# EAGLE design pnp_fuzz_face_clone (EAGLE 5.07)
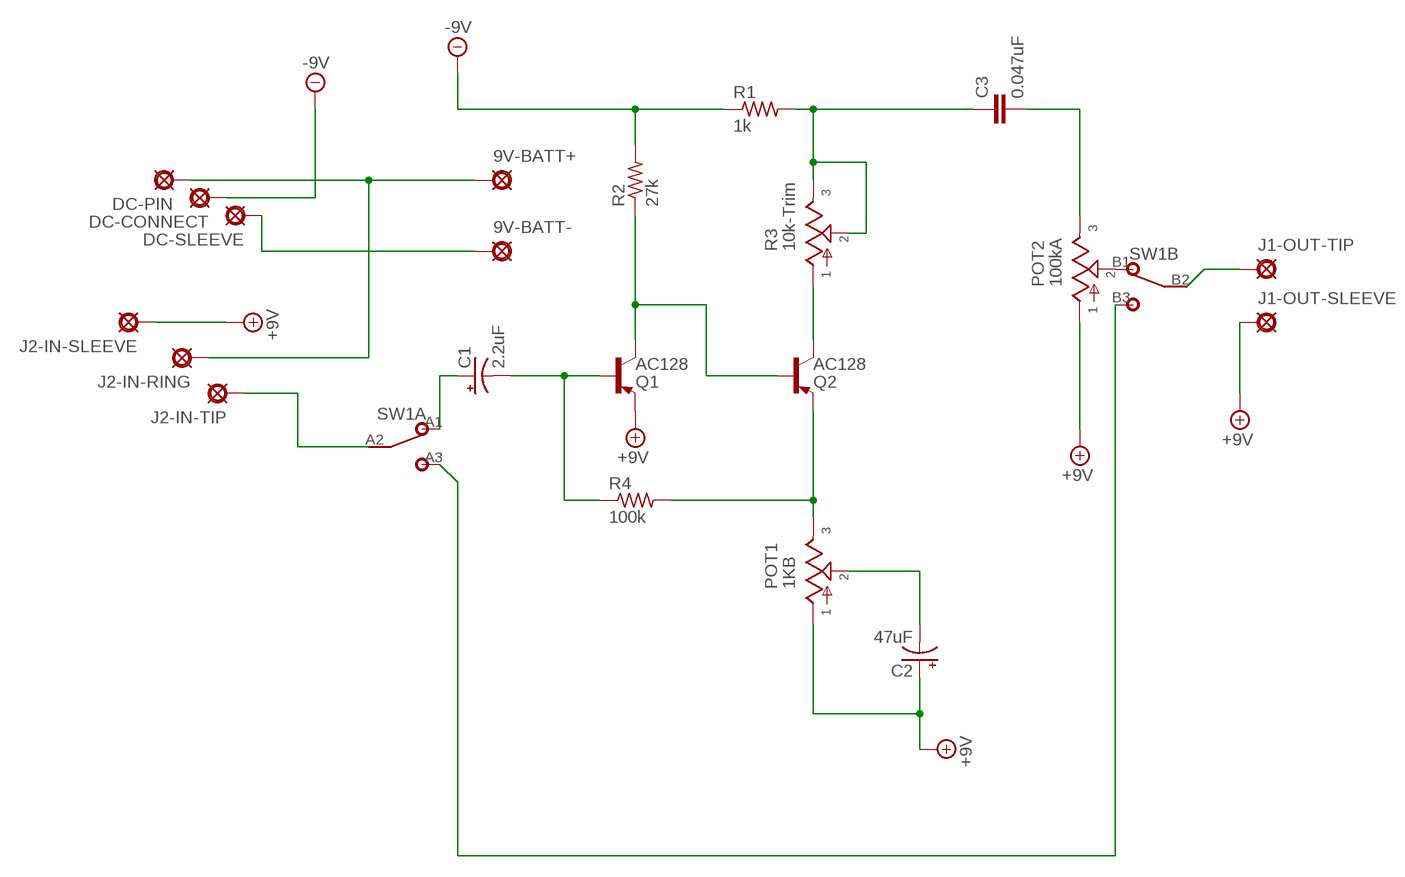
[diagram p0: schematic, sheet 1]

## Parts
9V-BATT+  PAD  [SQUARE]
9V-BATT-  PAD8  [OCTOGON]
C1  2.2uF  0502  [050_020_2]
C2  47uF  050  [050_020]
C3  0.047uF  099X056_036.3  [099X056_3]
DC-CONNECT  PAD8  [OCTOGON]
DC-PIN  PAD  [SQUARE]
DC-SLEEVE  PAD8  [OCTOGON]
J1-OUT-SLEEVE  PAD8  [OCTOGON]
J1-OUT-TIP  PAD  [SQUARE]
J2-IN-RING  PAD8  [OCTOGON]
J2-IN-SLEEVE  PAD8  [OCTOGON]
J2-IN-TIP  PAD8  [OCTOGON]
POT1  1KB  POT  [POT]
POT2  100kA  POT  [POT]
Q1  AC128  2N5087  [TO92]
Q2  AC128  2N5087  [TO92]
R1  1k  3MM.3  [R0204/3]
R2  27k  3MM.3  [R0204/3]
R3  10k-Trim  POTTRIM  [B25P]
R4  100k  3MM.3  [R0204/3]
SW1  DPDT  [DPDT]

## Nets
+9V: C2.+ J1-OUT-SLEEVE.1(PAD) J2-IN-SLEEVE.1(PAD) POT1.1 POT2.1 Q1.3(E)
-9V: DC-CONNECT.1(PAD) R1.1 R2.2
N$1: C1.- Q1.2(B) R4.1
N$2: 9V-BATT-.1(PAD) DC-SLEEVE.1(PAD)
N$3: 9V-BATT+.1(PAD) DC-PIN.1(PAD) J2-IN-RING.1(PAD)
N$4: POT2.2 SW1.B1
N$5: SW1.A3 SW1.B3
N$6: J1-OUT-TIP.1(PAD) SW1.B2
N$7: J2-IN-TIP.1(PAD) SW1.A2
N$8: POT1.3 Q2.3(E) R4.2
N$9: Q1.1(C) Q2.2(B) R2.1
N$10: Q2.1(C) R3.1
N$11: C1.+ SW1.A1
N$12: C3.1 R1.2 R3.2 R3.3
N$13: C3.2 POT2.3
N$14: C2.- POT1.2

## Library data of the parts
9V-BATT+ 9V-BATT- DC-CONNECT DC-PIN DC-SLEEVE J1-OUT-SLEEVE J1-OUT-TIP J2-IN-RING J2-IN-SLEEVE J2-IN-TIP = gm-supply:PAD: PAD use this package for pads with any purpose, including input, output, send or return various pad shapes: round, square, octogonal, long, and long offset
C1 C2 = gm-caps-electro-pol:050: 0.22 - 100uF Xicon values at Mouser.com: 10V: 10 - 100uF; 16V: 2.2 - 47uF; 25V: 0.47 - 47uF; 50V: 0.22 - 22uF
C3 = gm-caps-mica:099X056_036: 1 - 250pF Cornell Dubilier Electronics standard-dipped CD10: 500Vdc slightly smaller for smaller capacitances: 9.1mm x 4.8mm for 1 - 24pF CD15s are longer: 11.4 - 11.9mm and go up to 510pF
POT1 POT2 R3 = gm-pots:POT: Potentiometers the arrow indicates the clockwise motion of th wiper (lug 2) fully counter clockwise there is no resistance between lugs 1 and 2 fully clockwise the resistance between lugs 1 and 2 is the value of the pot
Q1 Q2 = gm-trans:2N5087: PNP Transistor
R1 R2 R4 = gm-resistors:3MM: 3mm Resistors Leads spaced 1-6 holes apart for 0.1" perfboard. Suitable for 1/8 watt resistors.
SW1 = gm-switches:DPDT

## Board
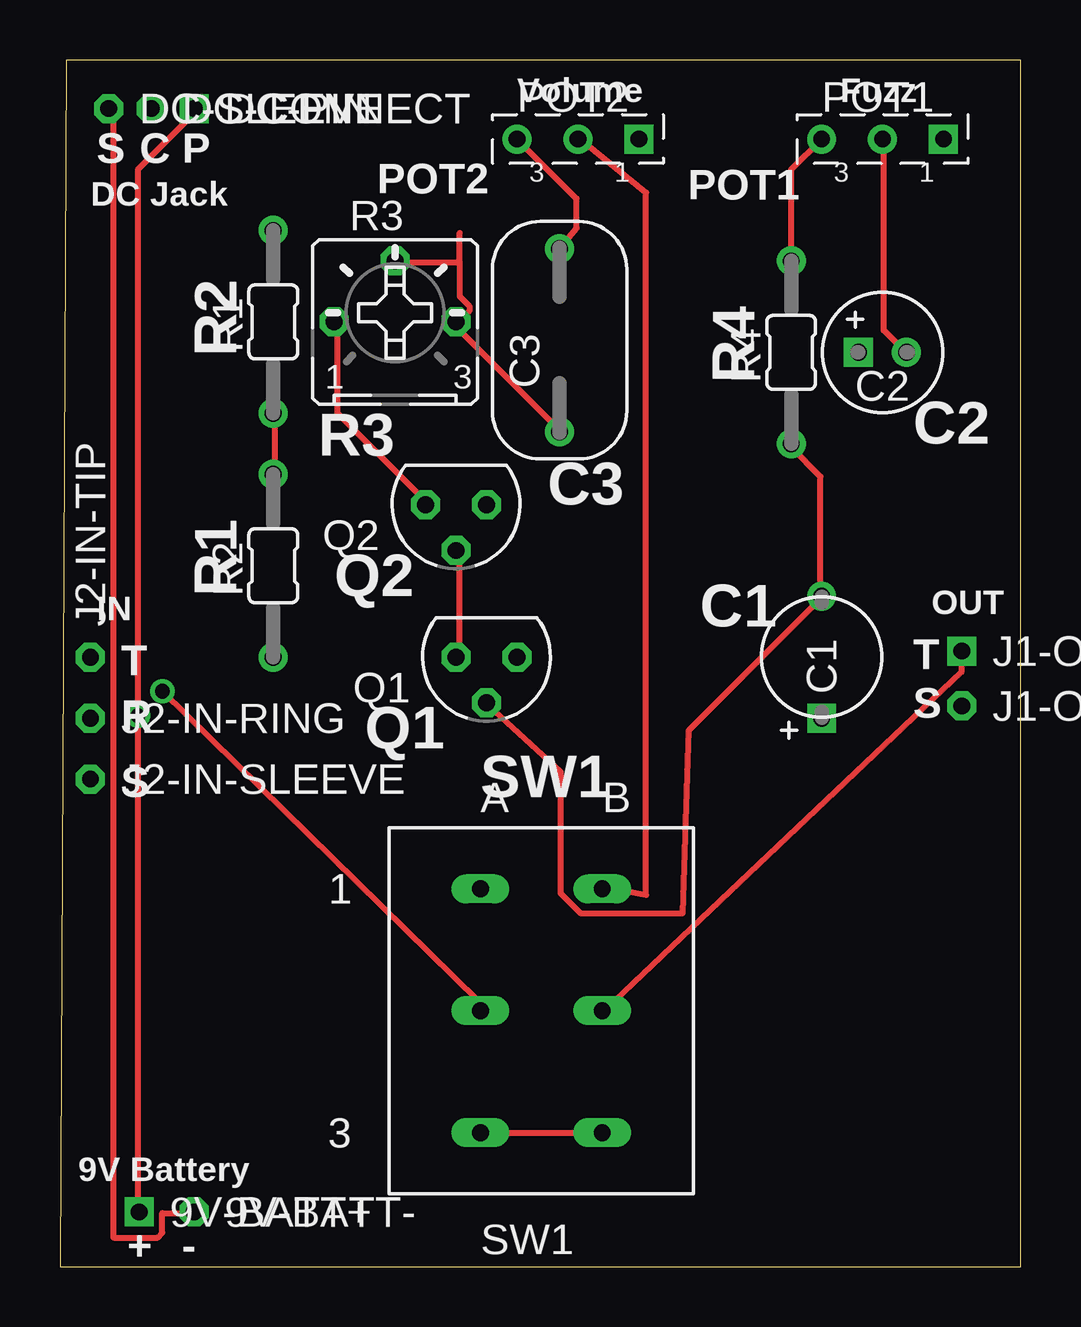
[diagram p1: board, top side]
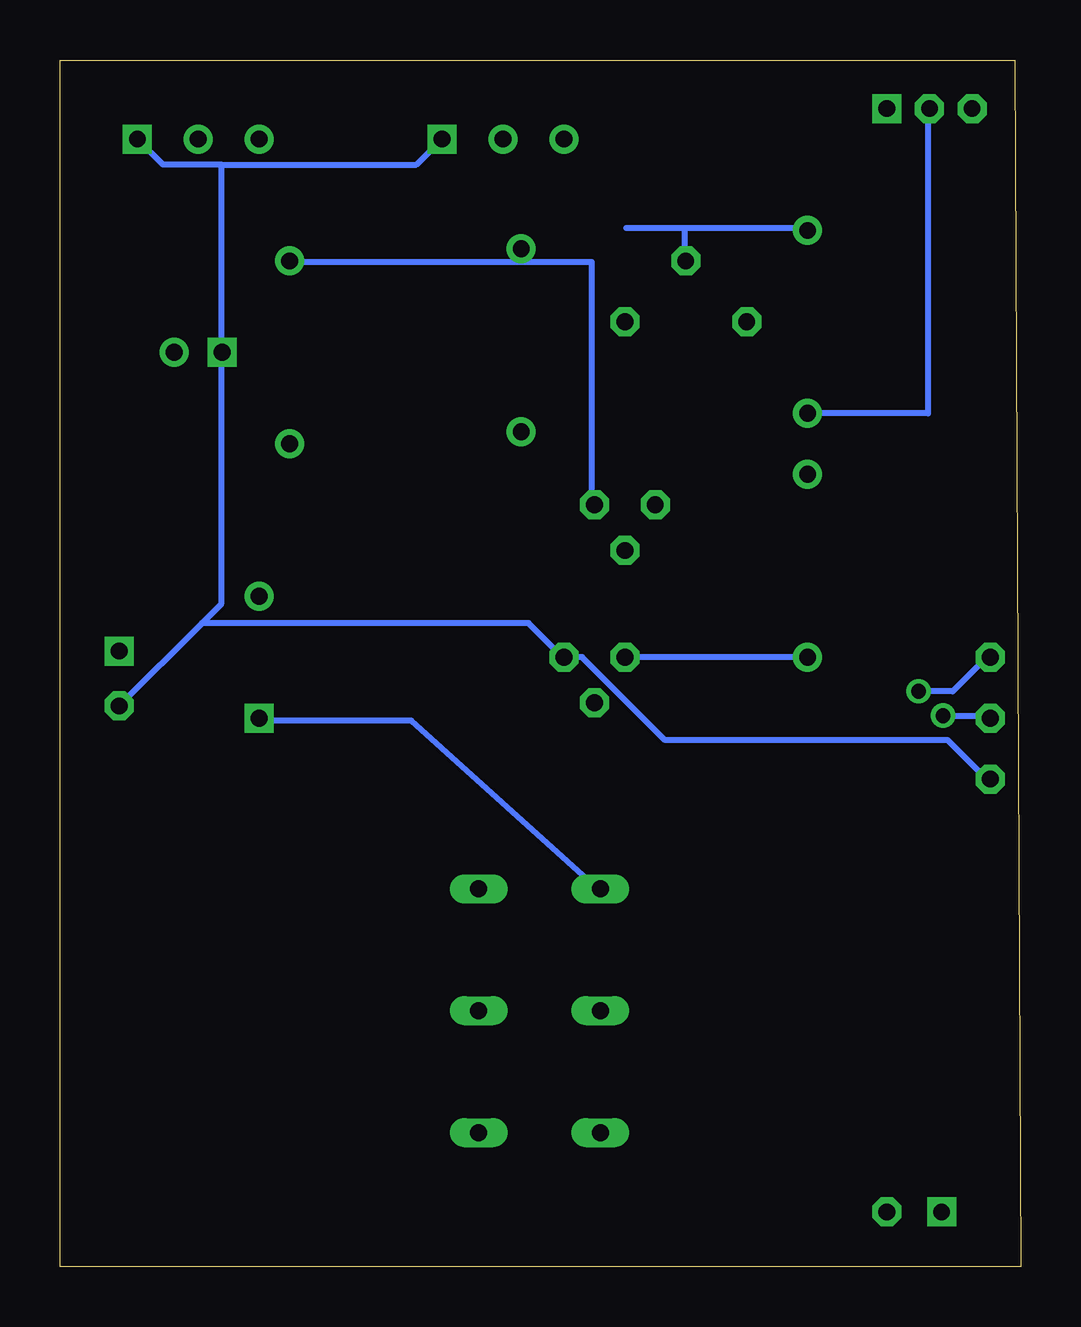
[diagram p2: board, bottom side, seen from below]

Size 40.06 x 50.28 mm. Coordinates in mm from the lower left corner, seen from the top.
Outline: 0,0 40.06,0 40.06,50.28 0.25,50.28 0,0
Copper layers (1*16): Top 0.035mm / dielectric 1.5mm / Bottom 0.035mm
Design rules "default": minimum track width 10mil, minimum drill 24mil, track to track 8mil, track to pad 8mil, pad to pad 8mil, via to via 8mil, smd to smd 8mil, copper to edge 40mil, drill to drill 8mil, minimum pad ring 10mil, minimum via ring 8mil, stop-mask expansion 4mil, vias tented up to drill 0mil, thermal gap 10mil

### Footprints (pad centres in the part's own frame; a part is rotated, then mirrored left to right if it is on the bottom)
SQUARE = drill 0.7 square: 1 0,0
OCTOGON = drill 0.7 octagon: 1 0,0
050_020_2 = drill 0.7 square: + -2.54,0 | drill 0.7 round: - 2.54,0
050_020 = drill 0.7 square: + -1,0 | drill 0.7 round: - 1,0
099X056_3 = drill 0.7 round: 1 -3.81,0; 2 3.81,0
POT = drill 0.7 square: 1 2.54,0 | drill 0.7 round: 2 0,0; 3 -2.54,0
TO92 = drill 0.7 octagon: 1 1.27,0; 2 0,1.905; 3 -1.27,0
R0204/3 = drill 0.7 round: 1 -3.81,0; 2 3.81,0
B25P = drill 0.7 octagon: 1 -2.54,0; 2 0,2.54; 3 2.54,0
DPDT = drill 0.7 long: A1 -2.54,5.08; A2 -2.54,0; A3 -2.54,-5.08; B1 2.54,5.08; B2 2.54,0; B3 2.54,-5.08

### Placement (x,y rotation side)
9V-BATT+  3.3,2.29 0 top
9V-BATT-  5.59,2.29 0 top
C1  31.75,25.4 90 top
C2  34.29,38.1 0 top
C3  20.83,38.61 90 top
DC-CONNECT  3.81,48.26 0 top
DC-PIN  5.59,48.26 0 top
DC-SLEEVE  2.03,48.26 0 top
J1-OUT-SLEEVE  37.59,23.37 0 top
J1-OUT-TIP  37.59,25.65 0 top
J2-IN-RING  1.27,22.86 0 top
J2-IN-SLEEVE  1.27,20.32 0 top
J2-IN-TIP  1.27,25.4 90 top
POT1  34.29,46.99 0 top
POT2  21.59,46.99 0 top
Q1  17.78,25.4 180 top
Q2  16.51,31.75 180 top
R1  8.89,39.37 90 top
R2  8.89,29.21 90 top
R3  13.97,39.37 0 top
R4  30.48,38.1 90 top
SW1  20.07,10.67 0 top

### Tracks (layer width: path | path; a pad name or v marks a point on that pad's centre or on a via)
+9V
  Bottom 0.254: 33.33,45.92 33.33,38.2 C2.+ 33.33,38 33.33,27.64 34.14,26.82 | 33.33,45.92 35.76,45.92 POT1.1 | 33.33,45.92 25.2,45.92 POT2.1 | 34.14,26.82 J1-OUT-SLEEVE.1 | 34.14,26.82 20.52,26.82 19.1,25.4 Q1.3 18.29,25.4 14.83,21.95 3.05,21.95 1.42,20.32 J2-IN-SLEEVE.1
-9V
  Top 0.254: R2.2 8.94,33.12 8.94,35.56 R1.1
  Bottom 0.254: DC-CONNECT.1 3.86,48.16 3.86,35.56 R1.1
N$1
  Top 0.254: Q1.2 17.88,23.37 20.88,20.62 20.88,15.54 21.69,14.73 25.96,14.73 26.21,22.35 31.7,27.84 C1.- 31.7,28.04 31.7,32.92 30.48,34.14 R4.1
N$2
  Top 0.254: 9V-BATT-.1 5.49,2.23 4.27,2.23 4.27,1.42 4.06,1.22 2.23,1.22 2.23,47.95 2.03,48.16 DC-SLEEVE.1
N$3  (via drill 0.61)
  Top 0.254: 9V-BATT+.1 3.25,2.44 v3.25,22.96 3.25,45.72 5.69,48.16 DC-PIN.1
  Bottom 0.254: v3.25,22.96 1.42,22.96 J2-IN-RING.1
N$4
  Top 0.254: SW1.B1 22.55,15.85 24.43,15.49 24.43,44.76 21.74,46.94 POT2.2
N$5
  Top 0.254: SW1.A3 SW1.B3
N$6
  Top 0.254: SW1.B2 22.71,10.67 37.59,24.79 J1-OUT-TIP.1
N$7  (via drill 0.61)
  Top 0.254: v4.27,23.98 17.42,11.07 17.42,10.67 SW1.A2
  Bottom 0.254: v4.27,23.98 2.85,23.98 1.42,25.4 J2-IN-TIP.1
N$8
  Top 0.254: POT1.3 30.48,45.72 R4.2
  Bottom 0.254: Q2.3 17.88,31.9 17.88,41.86 30.48,41.86 R4.2
N$9
  Top 0.254: Q2.2 16.66,29.67 16.66,25.4 Q1.1
  Bottom 0.254: R2.1 Q1.1
N$10
  Top 0.254: Q2.1 15.24,31.9 11.58,35.56 11.58,39.22 R3.1
N$11
  Bottom 0.254: SW1.A1 17.63,15.75 25.4,22.76 31.7,22.76 C1.+
N$12
  Top 0.254: 16.66,41.86 16.66,40.44 17.07,40.03 17.07,39.83 16.66,39.42 R3.3 16.66,39.22 16.66,39.01 20.73,34.95 C3.1 | 16.66,41.86 16.66,43.08 | 16.66,41.86 14.02,41.86 R3.2
  Bottom 0.254: 14.02,43.28 8.94,43.28 R1.2 | 14.02,43.28 16.46,43.28 | 14.02,43.28 14.02,42.06 R3.2
N$13
  Top 0.254: POT2.3 21.54,44.5 21.54,43.28 C3.2
N$14
  Top 0.254: C2.- 35.15,38.2 34.34,39.01 34.34,46.94 POT1.2

### Text on the board
tPlace: Volume | Fuzz | S | C | P | POT2 | DC Jack | POT1 | R2 | R4 | R3 | C2 | C3 | R1 | Q2 | IN | C1 | OUT | T | T | S | R | Q1 | S | SW1 | 9V Battery | + | -